# Altium schematic sheet DB_MOUNTS.SchDoc: Mounts, Logo & Label
size A4; SheetNumber: 9; SheetTotal: 20
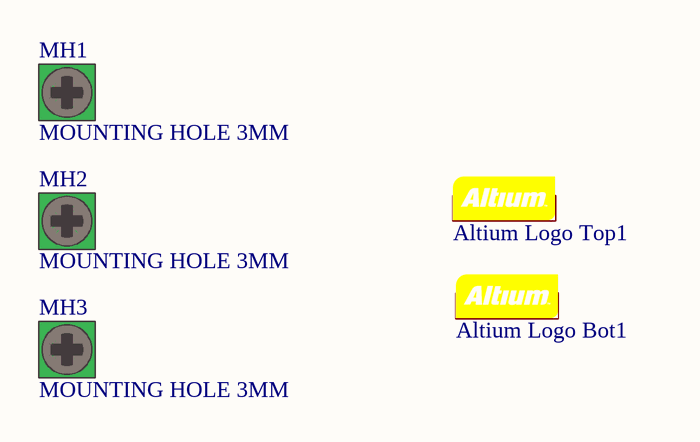
[diagram p0: DB_MOUNTS.SchDoc]

## Parts
Altium_Logo_Bot1  Altium  [Logo-Altium]  (value not drawn)  (no BOM)
Altium_Logo_Top1  Altium  [Logo-Altium]  (value not drawn)  (no BOM)
MH1  MOUNTING HOLE 3MM  [MOUNTING_HOLE_3MM]  (no BOM)
MH2  MOUNTING HOLE 3MM  [MOUNTING_HOLE_3MM]  (no BOM)
MH3  MOUNTING HOLE 3MM  [MOUNTING_HOLE_3MM]  (no BOM)

## Nets

Not connected (* = marked no-connect by the designer): MH1 1; MH2 1; MH3 1

## Notes on the sheet
- Sheet Title
- Project Title
- Size:
- Date:
- A4
- Assy:
- Time:
- Sheet
- Revision:
- of
- File:

## Library data of the parts
Altium_Logo_Bot1 Altium_Logo_Top1 = D-000-0003: Altium Logo for PCB; Category: Graphic-PCB; Status: Production
MH1-MH3 = D-001-0001: Mounting Hole, M3 Screw, Plated, Square Pad; Status: Production; Category: Mounting-Hole